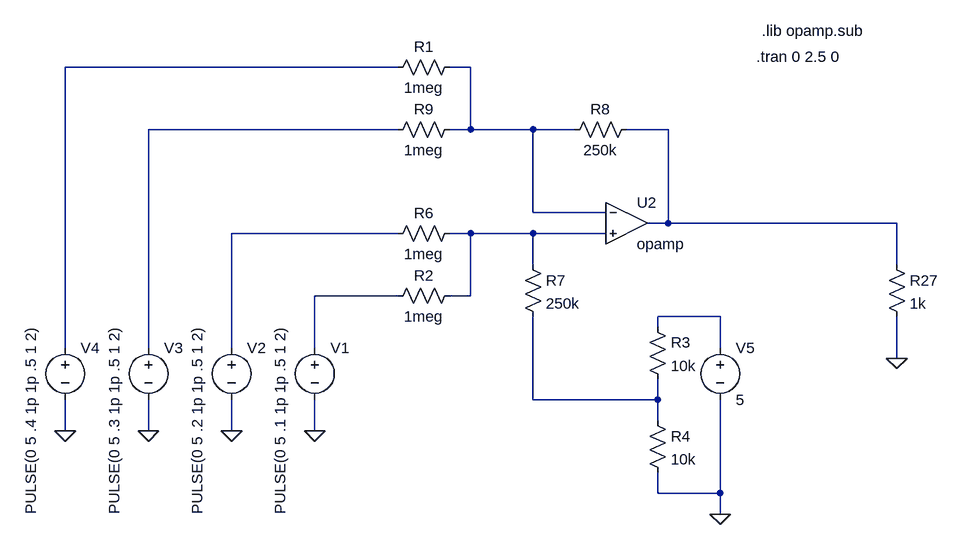
[diagram p0: schematic 4mixer.asc]
4mixer.asc, the LTspice schematic file:
Version 4
SHEET 1 4852 868
WIRE 1888 -192 1376 -192
WIRE 2000 -192 1968 -192
WIRE 1888 -96 1504 -96
WIRE 2000 -96 2000 -192
WIRE 2000 -96 1968 -96
WIRE 2096 -96 2000 -96
WIRE 2160 -96 2096 -96
WIRE 2304 -96 2240 -96
WIRE 2096 32 2096 -96
WIRE 2208 32 2096 32
WIRE 2304 48 2304 -96
WIRE 2304 48 2272 48
WIRE 2656 48 2304 48
WIRE 1888 64 1632 64
WIRE 2000 64 1968 64
WIRE 2096 64 2000 64
WIRE 2208 64 2096 64
WIRE 2096 112 2096 64
WIRE 2656 112 2656 48
WIRE 1888 160 1760 160
WIRE 2000 160 2000 64
WIRE 2000 160 1968 160
WIRE 2384 192 2288 192
WIRE 2288 208 2288 192
WIRE 1376 240 1376 -192
WIRE 1504 240 1504 -96
WIRE 1632 240 1632 64
WIRE 1760 240 1760 160
WIRE 2384 240 2384 192
WIRE 2656 256 2656 192
WIRE 2096 320 2096 192
WIRE 2288 320 2288 288
WIRE 2288 320 2096 320
WIRE 2288 352 2288 320
WIRE 1376 368 1376 320
WIRE 1504 368 1504 320
WIRE 1632 368 1632 320
WIRE 1760 368 1760 320
WIRE 2288 464 2288 432
WIRE 2384 464 2384 320
WIRE 2384 464 2288 464
WIRE 2384 496 2384 464
FLAG 2384 496 0
FLAG 2656 256 0
FLAG 1760 368 0
FLAG 1632 368 0
FLAG 1504 368 0
FLAG 1376 368 0
SYMBOL Opamps\\opamp 2240 -16 R0
SYMATTR InstName U2
SYMBOL res 2144 -80 R270
WINDOW 0 32 56 VTop 2
WINDOW 3 0 56 VBottom 2
SYMATTR InstName R8
SYMATTR Value 250k
SYMBOL res 1872 -80 R270
WINDOW 0 32 56 VTop 2
WINDOW 3 0 56 VBottom 2
SYMATTR InstName R9
SYMATTR Value 1meg
SYMBOL res 2640 96 R0
SYMATTR InstName R27
SYMATTR Value 1k
SYMBOL res 1872 80 R270
WINDOW 0 32 56 VTop 2
WINDOW 3 0 56 VBottom 2
SYMATTR InstName R6
SYMATTR Value 1meg
SYMBOL res 2080 96 R0
SYMATTR InstName R7
SYMATTR Value 250k
SYMBOL res 1872 -176 R270
WINDOW 0 32 56 VTop 2
WINDOW 3 0 56 VBottom 2
SYMATTR InstName R1
SYMATTR Value 1meg
SYMBOL res 1872 176 R270
WINDOW 0 32 56 VTop 2
WINDOW 3 0 56 VBottom 2
SYMATTR InstName R2
SYMATTR Value 1meg
SYMBOL voltage 1760 224 R0
WINDOW 3 -53 -18 VRight 2
WINDOW 123 0 0 Left 2
WINDOW 39 0 0 Left 2
SYMATTR Value PULSE(0 5 .1 1p 1p .5 1 2)
SYMATTR InstName V1
SYMBOL voltage 1632 224 R0
WINDOW 3 -53 -18 VRight 2
WINDOW 123 0 0 Left 2
WINDOW 39 0 0 Left 2
SYMATTR Value PULSE(0 5 .2 1p 1p .5 1 2)
SYMATTR InstName V2
SYMBOL voltage 1504 224 R0
WINDOW 3 -53 -18 VRight 2
WINDOW 123 0 0 Left 2
WINDOW 39 0 0 Left 2
SYMATTR Value PULSE(0 5 .3 1p 1p .5 1 2)
SYMATTR InstName V3
SYMBOL voltage 1376 224 R0
WINDOW 3 -53 -18 VRight 2
WINDOW 123 0 0 Left 2
WINDOW 39 0 0 Left 2
SYMATTR Value PULSE(0 5 .4 1p 1p .5 1 2)
SYMATTR InstName V4
SYMBOL voltage 2384 224 R0
WINDOW 123 0 0 Left 2
WINDOW 39 0 0 Left 2
SYMATTR InstName V5
SYMATTR Value 5
SYMBOL res 2272 192 R0
SYMATTR InstName R3
SYMATTR Value 10k
SYMBOL res 2272 336 R0
SYMATTR InstName R4
SYMATTR Value 10k
TEXT 2440 -208 Left 2 !.tran 0 2.5 0
TEXT 2448 -248 Left 2 !.lib opamp.sub

The netlist it stands for:
* 4mixer.asc
XU2 N002 N006 N004 opamp Aol=100K GBW=10Meg  ; pins invin noninvin out
R8 N002 N004 250k
R9 N003 N002 1meg
R27 N004 0 1k
R6 N005 N006 1meg
R7 N006 N009 250k
R1 N001 N002 1meg
R2 N007 N006 1meg
V1 N007 0 PULSE(0 5 .1 1p 1p .5 1 2)
V2 N005 0 PULSE(0 5 .2 1p 1p .5 1 2)
V3 N003 0 PULSE(0 5 .3 1p 1p .5 1 2)
V4 N001 0 PULSE(0 5 .4 1p 1p .5 1 2)
V5 N008 0 5
R3 N008 N009 10k
R4 N009 0 10k
.tran 0 2.5 0
.lib opamp.sub
.backanno
.end